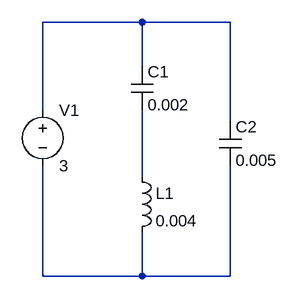
[diagram p0: schematic 2capindseries1capparallel.asc]
2capindseries1capparallel.asc, the LTspice schematic file:
Version 4
SHEET 1 880 680
WIRE 240 0 96 0
WIRE 368 0 240 0
WIRE 240 64 240 0
WIRE 96 128 96 0
WIRE 368 144 368 0
WIRE 240 224 240 128
WIRE 96 368 96 208
WIRE 240 368 240 304
WIRE 240 368 96 368
WIRE 368 368 368 208
WIRE 368 368 240 368
SYMBOL voltage 96 112 R0
WINDOW 123 0 0 Left 0
WINDOW 39 0 0 Left 0
SYMATTR InstName V1
SYMATTR Value 3
SYMBOL cap 224 64 R0
SYMATTR InstName C1
SYMATTR Value 0.002
SYMBOL cap 352 144 R0
SYMATTR InstName C2
SYMATTR Value 0.005
SYMBOL ind 224 208 R0
SYMATTR InstName L1
SYMATTR Value 0.004

The netlist it stands for:
* 2capindseries1capparallel.asc
V1 N001 N003 3
C1 N001 N002 0.002
C2 N001 N003 0.005
L1 N002 N003 0.004
.backanno
.end